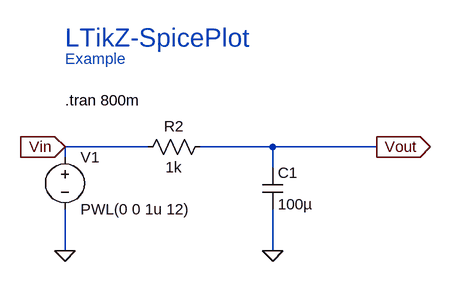
[diagram p0: schematic rc.asc]
rc.asc, the LTspice schematic file:
Version 4
SHEET 1 880 680
WIRE 0 160 -128 160
WIRE 192 160 80 160
WIRE 352 160 192 160
WIRE -128 176 -128 160
WIRE 192 192 192 160
WIRE -128 320 -128 256
WIRE 192 320 192 256
FLAG 192 320 0
FLAG -128 160 Vin
IOPIN -128 160 In
FLAG 352 160 Vout
IOPIN 352 160 Out
FLAG -128 320 0
SYMBOL res 96 144 R90
WINDOW 0 0 56 VBottom 2
WINDOW 3 32 56 VTop 2
SYMATTR InstName R2
SYMATTR Value 1k
SYMBOL cap 176 192 R0
SYMATTR InstName C1
SYMATTR Value 100µ
SYMBOL voltage -128 160 R0
WINDOW 123 0 0 Left 0
WINDOW 39 0 0 Left 0
SYMATTR InstName V1
SYMATTR Value PWL(0 0 1u 12)
TEXT -128 88 Left 2 !.tran 800m
TEXT -128 -8 Left 4 ;LTikZ-SpicePlot
TEXT -128 24 Left 2 ;Example

The netlist it stands for:
* rc.asc
R2 Vout Vin 1k
C1 Vout 0 100µ
V1 Vin 0 PWL(0 0 1u 12)
.tran 800m
* LTikZ-SpicePlot
* Example
.backanno
.end